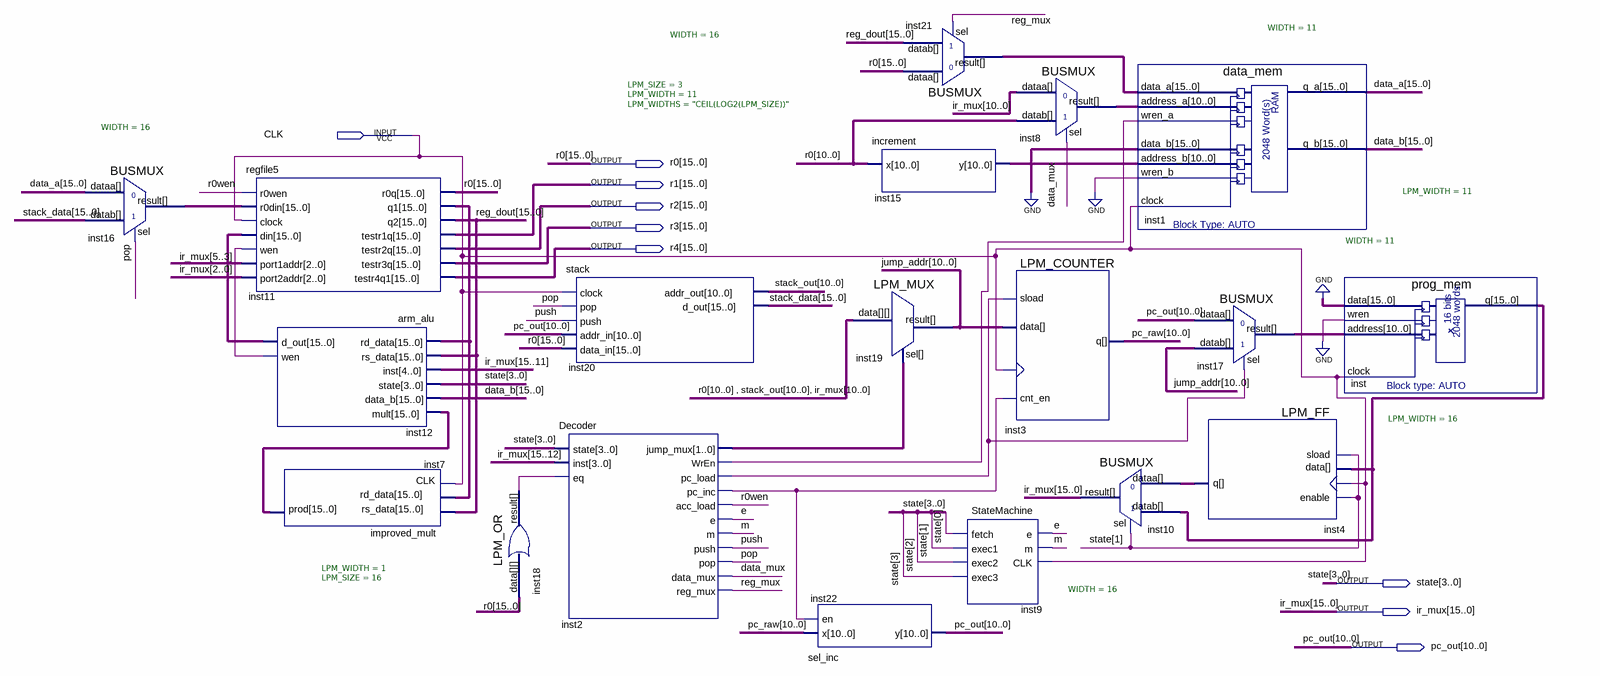
[diagram p0: schematic sheet]
// Quartus schematic HarvardArch.bdf as structural Verilog: 19 symbols, 9 pins
module HarvardArch (
  input  CLK,
  output [15:0] r0,
  output [15:0] r1,
  output [15:0] r2,
  output [15:0] r3,
  output [15:0] r4,
  output [3:0] state,
  output [15:0] ir_mux,
  output [10:0] pc_out
);

  wire data_mux, e, inst2_pc_inc, inst2_pc_load, inst2_wren, inst12_wen, inst18_result, m, pop, push, r0wen,
       reg_mux;
  wire [1:0] inst2_jump_mux;
  wire [10:0] inst8_result, inst15_y, inst17_result, jump_addr, pc_raw, stack_out;
  wire [15:0] data_a, data_b, inst4_q, inst7_prod, inst11_q1, inst12_d_out, inst16_result, inst21_result,
       inst_q, reg_dout, stack_data;

  BUSMUX #(.WIDTH(16)) inst16 (.datab(stack_data), .sel(pop), .dataa(data_a), .result(inst16_result));
  regfile5 inst11 (
    .r0wen(r0wen), .r0din(inst16_result), .clock(CLK), .din(inst12_d_out), .wen(inst12_wen),
    .port1addr(ir_mux[5:3]), .port2addr(ir_mux[2:0]), .r0q(r0), .q1(inst11_q1), .q2(reg_dout), .testr1q(r1),
    .testr2q(r2), .testr3q(r3), .testr4q1(r4));
  arm_alu inst12 (
    .rd_data(inst11_q1), .rs_data(reg_dout), .inst(ir_mux[15:11]), .state(state), .data_b(data_b),
    .mult(inst7_prod), .d_out(inst12_d_out), .wen(inst12_wen));
  improved_mult inst7 (.rs_data(reg_dout), .rd_data(inst11_q1), .CLK(CLK), .prod(inst7_prod));
  LPM_OR #(.LPM_WIDTH(1), .LPM_SIZE(16)) inst18 (.data(r0), .result(inst18_result));
  stack inst20 (
    .clock(CLK), .pop(pop), .push(push), .addr_in(pc_out), .data_in(r0), .addr_out(stack_out),
    .d_out(stack_data));
  Decoder inst2 (
    .state(state), .inst(ir_mux[15:12]), .eq(inst18_result), .jump_mux(inst2_jump_mux), .WrEn(inst2_wren),
    .pc_load(inst2_pc_load), .pc_inc(inst2_pc_inc), .acc_load(r0wen), .e(e), .m(m), .push(push), .pop(pop),
    .data_mux(data_mux), .reg_mux(reg_mux));
  sel_inc inst22 (.x(pc_raw), .en(inst2_pc_inc), .y(pc_out));
  increment inst15 (.x(r0[10:0]), .y(inst15_y));
  LPM_MUX #(.LPM_SIZE(3), .LPM_WIDTH(11), .LPM_WIDTHS("CEIL(LOG2(LPM_SIZE))")) inst19 (
    .data({r0[10:0], stack_out, ir_mux[10:0]}), .sel(inst2_jump_mux), .result(jump_addr));
  BUSMUX #(.WIDTH(16)) inst21 (.datab(reg_dout), .sel(reg_mux), .dataa(r0), .result(inst21_result));
  StateMachine inst9 (.e(e), .m(m), .CLK(CLK), .fetch(state[0]), .exec1(state[1]), .exec2(state[2]), .exec3(state[3]));
  BUSMUX #(.WIDTH(11)) inst8 (.datab(r0[10:0]), .sel(data_mux), .dataa(ir_mux[10:0]), .result(inst8_result));
  LPM_COUNTER #(.LPM_WIDTH(11)) inst3 (
    .sload(inst2_pc_load), .data(jump_addr), .clock(CLK), .cnt_en(inst2_pc_inc), .q(pc_raw));
  BUSMUX #(.WIDTH(16)) inst10 (.datab(inst_q), .sel(state[1]), .dataa(inst4_q), .result(ir_mux));
  data_mem inst1 (
    .data_a(inst21_result), .address_a(inst8_result), .wren_a(inst2_wren), .data_b({16{1'b0}}),
    .address_b(inst15_y), .wren_b(1'b0), .clock(CLK), .q_a(data_a), .q_b(data_b));
  BUSMUX #(.WIDTH(11)) inst17 (.datab(jump_addr), .sel(inst2_pc_load), .dataa(pc_out), .result(inst17_result));
  LPM_FF #(.LPM_WIDTH(16)) inst4 (.enable(state[1]), .clock(CLK), .sload(state[1]), .data(inst_q), .q(inst4_q));
  prog_mem inst (.data({16{1'b0}}), .wren(1'b0), .address(inst17_result), .clock(CLK), .q(inst_q));
endmodule
